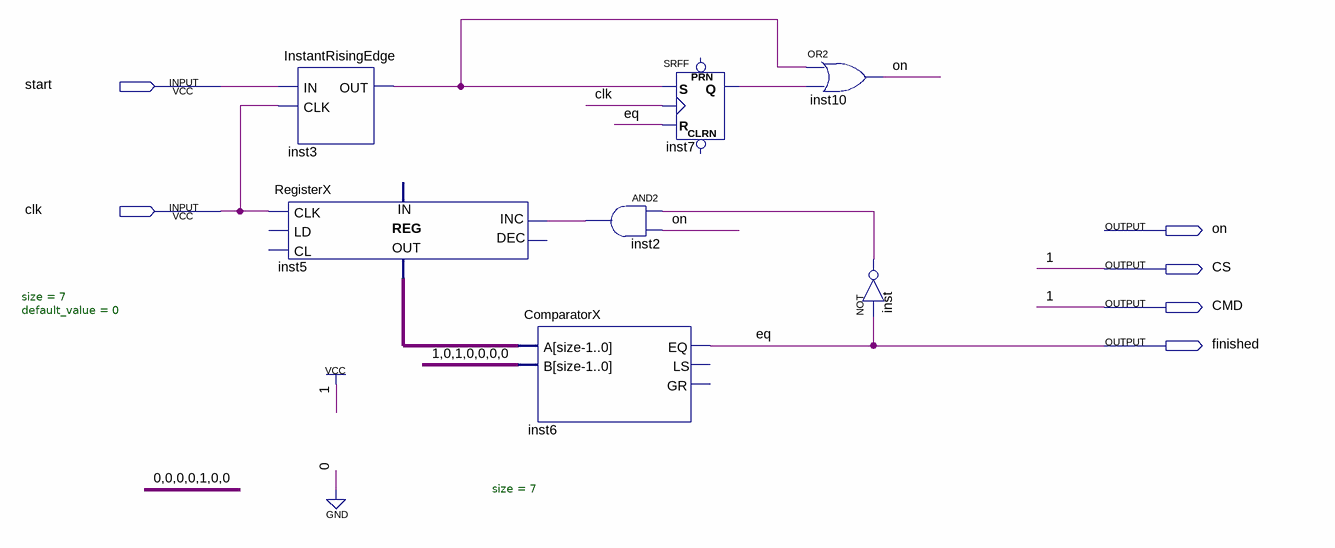
[diagram p0: schematic sheet]
// Quartus schematic sync.bdf as structural Verilog: 7 symbols, 6 pins
module sync (
  input  start,
  input  clk,
  output on,
  output CS,
  output CMD,
  output finished
);

  wire inst2_out, inst3_out, inst7_q, inst_out;
  wire [6:0] inst5_data_out;

  InstantRisingEdge inst3 (.IN(start), .CLK(clk), .OUT(inst3_out));
  RegisterX #(.size(7), .default_value(0)) inst5 (
    .CLK(clk), .INC(inst2_out), .DATA_OUT(inst5_data_out));  // open: LD, CL, DEC, DATA_IN
  ComparatorX #(.size(7)) inst6 (.A(inst5_data_out), .B(7'b1010000), .EQ(finished));  // open: LS, GR
  and inst2 (inst2_out, inst_out, on);
  SRFF inst7 (.S(inst3_out), .R(finished), .CLK(clk), .Q(inst7_q));  // open: PRN, CLRN
  or inst10 (on, inst3_out, inst7_q);
  not inst (inst_out, finished);

  assign CMD = 1'b1;
  assign CS = 1'b1;

  // Other names for the same wires on the sheet: eq = finished
endmodule
